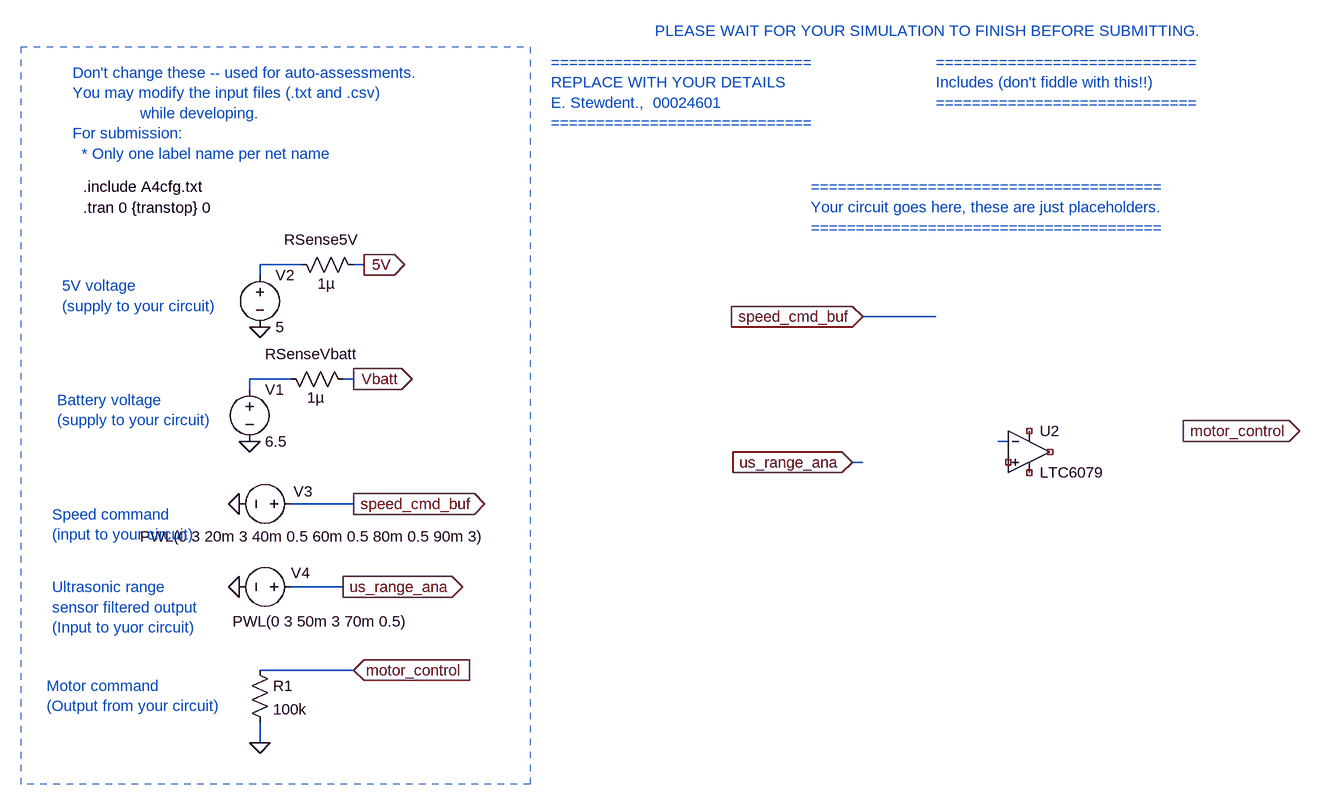
[diagram p0: schematic E344_12345678_A4a.asc]
E344_12345678_A4a.asc, the LTspice schematic file:
Version 4
SHEET 1 1824 2192
WIRE -1936 -1088 -2000 -1088
WIRE -1840 -1088 -1856 -1088
WIRE -2000 -1072 -2000 -1088
WIRE -960 -1008 -1072 -1008
WIRE -1952 -912 -2016 -912
WIRE -1856 -912 -1872 -912
WIRE -2016 -896 -2016 -912
WIRE -848 -816 -864 -816
WIRE -1072 -784 -1088 -784
WIRE -1856 -720 -1952 -720
WIRE -1872 -592 -1952 -592
WIRE -1856 -464 -2000 -464
WIRE -2000 -352 -2000 -384
FLAG -1840 -1088 5V
IOPIN -1840 -1088 Out
FLAG -2000 -992 0
FLAG -1072 -1008 speed_cmd_buf
IOPIN -1072 -1008 In
FLAG -400 -832 motor_control
IOPIN -400 -832 In
FLAG -1088 -784 us_range_ana
IOPIN -1088 -784 In
FLAG -1856 -912 Vbatt
IOPIN -1856 -912 Out
FLAG -2016 -816 0
FLAG -1856 -720 speed_cmd_buf
IOPIN -1856 -720 Out
FLAG -1872 -592 us_range_ana
IOPIN -1872 -592 Out
FLAG -2032 -720 0
FLAG -2032 -592 0
FLAG -1856 -464 motor_control
IOPIN -1856 -464 In
FLAG -2000 -352 0
SYMBOL voltage -2000 -1088 R0
WINDOW 123 0 0 Left 0
WINDOW 39 0 0 Left 0
SYMATTR InstName V2
SYMATTR Value 5
SYMBOL res -1952 -1104 M90
WINDOW 0 -7 47 VBottom 2
WINDOW 3 29 54 VTop 2
SYMATTR InstName RSense5V
SYMATTR Value 1µ
SYMBOL Opamps\\LTC6079 -816 -800 R0
SYMATTR InstName U2
SYMBOL voltage -2016 -912 R0
WINDOW 123 0 0 Left 0
WINDOW 39 0 0 Left 0
SYMATTR InstName V1
SYMATTR Value 6.5
SYMBOL res -1968 -928 M90
WINDOW 0 -7 47 VBottom 2
WINDOW 3 29 54 VTop 2
SYMATTR InstName RSenseVbatt
SYMATTR Value 1µ
SYMBOL voltage -1936 -720 R90
WINDOW 123 0 0 Left 0
WINDOW 39 0 0 Left 0
WINDOW 0 -19 -17 VRight 2
WINDOW 3 50 -286 VRight 2
SYMATTR InstName V3
SYMATTR Value PWL(0 3 20m 3 40m 0.5 60m 0.5 80m 0.5 90m 3)
SYMBOL voltage -1936 -592 R90
WINDOW 123 0 0 Left 0
WINDOW 39 0 0 Left 0
WINDOW 0 -22 -13 VRight 2
WINDOW 3 53 -165 VRight 2
SYMATTR InstName V4
SYMATTR Value PWL(0 3 50m 3 70m 0.5)
SYMBOL res -2016 -480 R0
SYMATTR InstName R1
SYMATTR Value 100k
TEXT -2288 -1384 Left 2 ;Don't change these -- used for auto-assessments.\nYou may modify the input files (.txt and .csv) \n               while developing.\nFor submission: \n  * Only one label name per net name
TEXT -1552 -1400 Left 2 ;=============================\nREPLACE WITH YOUR DETAILS\nE. Stewdent.,  00024601\n=============================
TEXT -960 -1400 Left 2 ;=============================\nIncludes (don't fiddle with this!!)\n=============================
TEXT -1152 -1208 Left 2 ;=======================================\nYour circuit goes here, these are just placeholders.\n=======================================
TEXT -1392 -1448 Left 2 ;PLEASE WAIT FOR YOUR SIMULATION TO FINISH BEFORE SUBMITTING.
TEXT -2272 -1176 Left 2 !.tran 0 {transtop} 0
TEXT -2272 -1208 Left 2 !.include A4cfg.txt
TEXT -2320 -704 Left 2 ;Speed command\n(input to your circuit)
TEXT -2320 -592 Left 2 ;Ultrasonic range\nsensor filtered output\n(Input to yuor circuit)
TEXT -2328 -440 Left 2 ;Motor command\n(Output from your circuit)
TEXT -2312 -880 Left 2 ;Battery voltage \n(supply to your circuit)
TEXT -2304 -1056 Left 2 ;5V voltage \n(supply to your circuit)
LINE Normal -1584 -1424 -1584 -288 2
LINE Normal -2368 -1424 -1584 -1424 2
LINE Normal -1584 -288 -2368 -288 2
LINE Normal -1584 -304 -1584 -304 2
LINE Normal -2368 -1424 -2368 -288 2

The netlist it stands for:
* E344_12345678_A4a.asc
V2 N001 0 5
RSense5V N001 5V 1µ
XU2 NC_01 N003 NC_02 NC_03 NC_04 LTC6078  ; LTC6079, pins In+ In- V+ V- OUT
V1 N002 0 6.5
RSenseVbatt N002 Vbatt 1µ
V3 speed_cmd_buf 0 PWL(0 3 20m 3 40m 0.5 60m 0.5 80m 0.5 90m 3)
V4 us_range_ana 0 PWL(0 3 50m 3 70m 0.5)
R1 motor_control 0 100k
* Don't change these -- used for auto-assessments.
* You may modify the input files (.txt and .csv)
*                while developing.
* For submission:
*   * Only one label name per net name
* =============================
* REPLACE WITH YOUR DETAILS
* E. Stewdent.,  00024601
* =============================
* =============================
* Includes (don't fiddle with this!!)
* =============================
* =======================================
* Your circuit goes here, these are just placeholders.
* =======================================
* PLEASE WAIT FOR YOUR SIMULATION TO FINISH BEFORE SUBMITTING.
.tran 0 {transtop} 0
.include A4cfg.txt
* Speed command
* (input to your circuit)
* Ultrasonic range
* sensor filtered output
* (Input to yuor circuit)
* Motor command
* (Output from your circuit)
* Battery voltage
* (supply to your circuit)
* 5V voltage
* (supply to your circuit)
.lib LTC5.lib
.backanno
.end